# EAGLE design adapter (EAGLE 9.1.3)
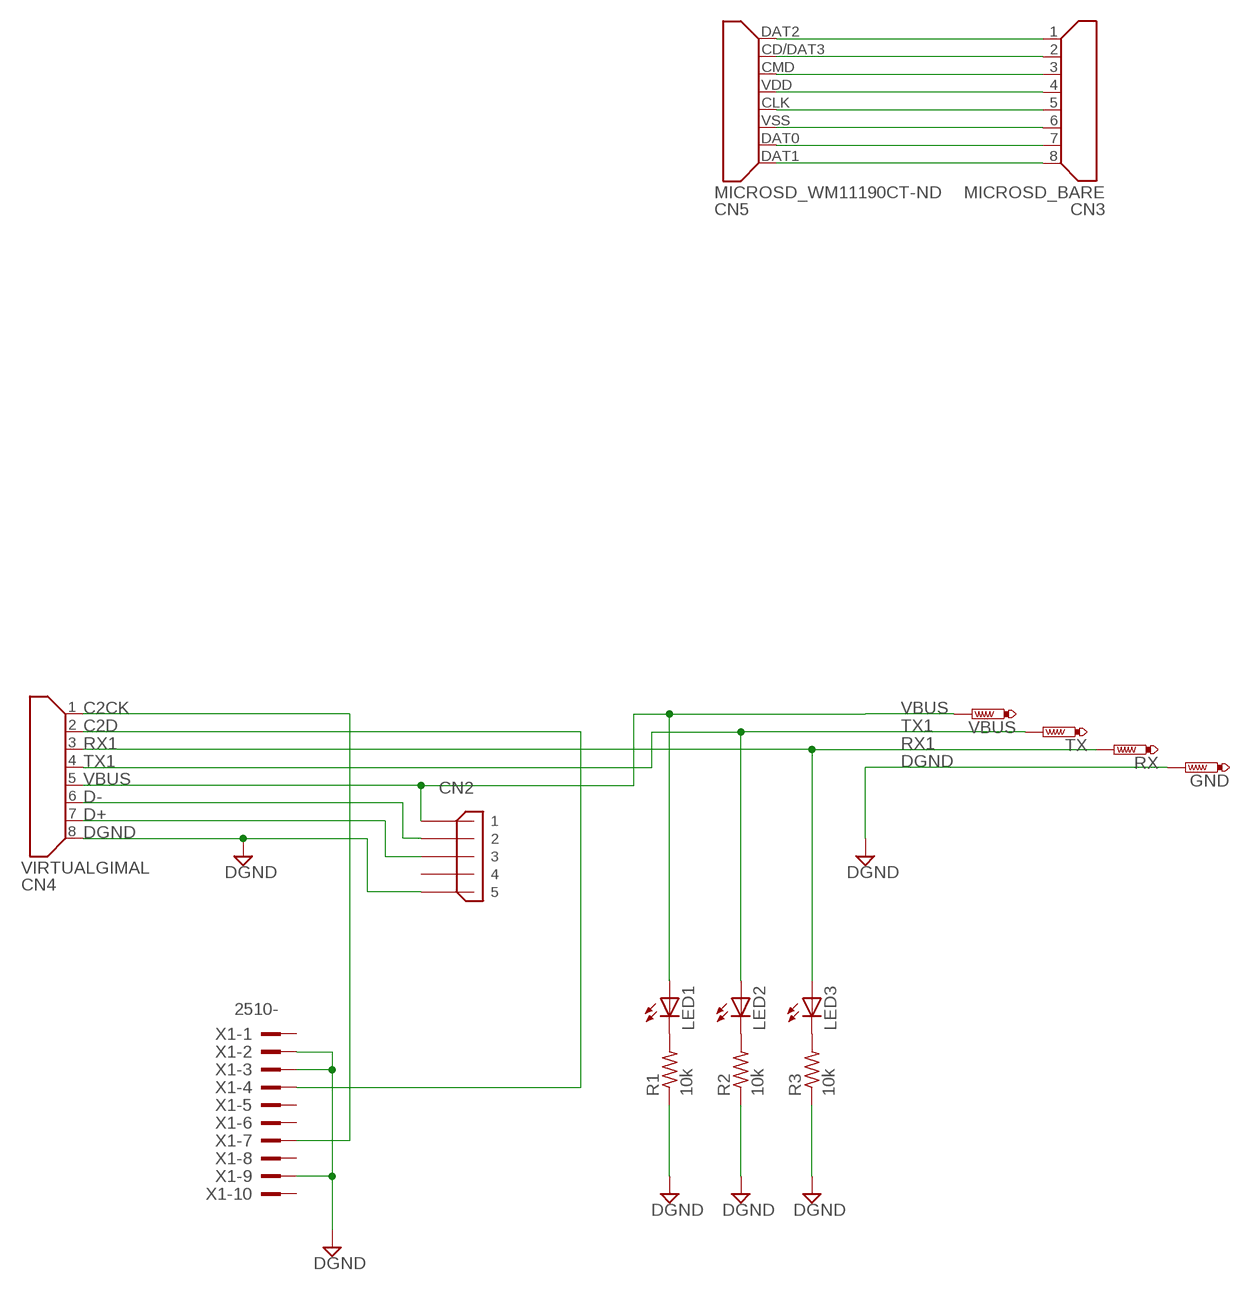
[diagram p0: schematic, sheet 1]

## Parts
CN2  MICROUSB_ZX62D1-B-5PA(30)  [ZX62D1-B-5PA(30)]
CN3  MICROSD_BARE  [MICROSD]
CN4  VIRTUALGIMAL  [VIRTUALGIMBAL]
CN5  MICROSD_WM11190CT-ND  [5033981892]
GND  PTR1TP19R  [TP19R]
LED1  LEDSML0603  [SML0603]
LED2  LEDSML0603  [SML0603]
LED3  LEDSML0603  [SML0603]
R1  10k  R-US_R0402  [R0402]
R2  10k  R-US_R0402  [R0402]
R3  10k  R-US_R0402  [R0402]
RX  PTR1TP19R  [TP19R]
TX  PTR1TP19R  [TP19R]
VBUS  PTR1TP19R  [TP19R]
X1  2510-  [PAK100/2500-10]

## Nets
C2CK [Signal]: CN4.1 X1.7
C2D [Signal]: CN4.2 X1.4
D+ [Signal]: CN2.3_D+ CN4.7
D- [Signal]: CN2.2_D- CN4.6
DGND: CN2.5_GND CN4.8 GND.TP R1.1 R2.1 R3.1 X1.2 X1.3 X1.9
N$1: LED1.C R1.2
N$2: LED2.C R2.2
N$3: LED3.C R3.2
N$4 [Signal]: CN3.1 CN5.DAT2
N$5 [Signal]: CN3.2 CN5.CD/DAT3
N$6 [Signal]: CN3.3 CN5.CMD
N$7: CN3.4 CN5.VDD
N$8 [Signal]: CN3.5 CN5.CLK
N$9: CN3.6 CN5.VSS
N$10 [Signal]: CN3.7 CN5.DAT0
N$11 [Signal]: CN3.8 CN5.DAT1
RX1 [Signal]: CN4.3 LED3.A RX.TP
TX1 [Signal]: CN4.4 LED2.A TX.TP
VBUS: CN2.1_VCC CN4.5 LED1.A VBUS.TP
Unconnected: CN2.4_ID X1.1 X1.5 X1.6 X1.8 X1.10

## Library data of the parts
CN2 = connector:MICROUSB_ZX62D1-B-5PA(30)
CN3 = connector:MICROSD_BARE
CN4 = connector:VIRTUALGIMAL
CN5 = connector:MICROSD_WM11190CT-ND
GND RX TX VBUS = testpad:PTR1: TEST PIN
LED1-LED3 = led:LED: LED OSRAM: - CHIPLED LG R971, LG N971, LY N971, LG Q971, LY Q971, LO R971, LY R971 LH N974, LH R974 LS Q976, LO Q976, LY Q976 LO Q996 - Hyper CHIPLED LW Q18S LB Q993, LB Q99A, LB R99A - SideLED LS A670, LO A670, LY A670, LG A670, LP A670 LB A673, LV A673, LT A673, LW A673 LH A674 LY A675 LS A676, LA A676, LO A676, LY A676, LW A676 LS A679, LY A679, LG A679 - Hyper Micro SIDELED® LS Y876, LA Y876, LO Y876, LY Y876 LT Y87S - SmartLED LW L88C, LW L88S LB L89C, LB L89S, LG L890 LS L89K, LO L89K, LY L89K LS L896, LA L896, LO L896, LY L896 - TOPLED LS T670, LO T670, LY T670, LG T670, LP T670 LSG T670, LSP T670, LSY T670, LOP T670, LYG T670 LG T671, LOG T671, LSG T671 LB T673, LV T673, LT T673, LW T673 LH T674 LS T676, LA T676, LO T676, LY T676, LB T676, LH T676, LSB T676, LW T676 LB T67C, LV T67C, LT T67C, LS T67K, LO T67K, LY T67K, LW E67C LS E67B, LA E67B, LO E67B, LY E67B, LB E67C, LV E67C, LT E67C LW T67C LS T679, LY T679, LG T679 LS T770, LO T770, LY T770, LG T770, LP T770 LB T773, LV T773, LT T773, LW T773 LH T774 LS E675, LA E675, LY E675, LS T675 LS T776, LA T776, LO T776, LY T776, LB T776 LHGB T686 LT T68C, LB T68C - Hyper Mini TOPLED® LB M676 - Mini TOPLED Santana® LG M470 LS M47K, LO M47K, LY M47K Source: http://www.osram.convergy.de LUXEON: - LUMILED® LXK2-PW12-R00, LXK2-PW12-S00, LXK2-PW14-U00, LXK2-PW14-V00 LXK2-PM12-R00, LXK2-PM12-S00, LXK2-PM14-U00 LXK2-PE12-Q00, LXK2-PE12-R00, LXK2-PE12-S00, LXK2-PE14-T00, LXK2-PE14-U00 LXK2-PB12-K00, LXK2-PB12-L00, LXK2-PB12-M00, LXK2-PB14-N00, LXK2-PB14-P00, LXK2-PB14-Q00 LXK2-PR12-L00, LXK2-PR12-M00, LXK2-PR14-Q00, LXK2-PR14-R00 LXK2-PD12-Q00, LXK2-PD12-R00, LXK2-PD12-S00 LXK2-PH12-R00, LXK2-PH12-S00 LXK2-PL12-P00, LXK2-PL12-Q00, LXK2-PL12-R00 Source: www.luxeon.com KINGBRIGHT: KA-3528ASYC Source: www.kingbright.com
R1-R3 = rcl:R-US_: RESISTOR, American symbol; SPICEPREFIX: R
X1 = con-3m:2510-: 3M (TM) Pak 100 4-Wall Header Source: 3M; MF: 3M; MPN: 2510-6002UB; OC_FARNELL: 9838244; OC_NEWARK: 46F4725

## Net classes
0 PWR: width 0.254 mm
1 Signal: width 0.152 mm

## Board
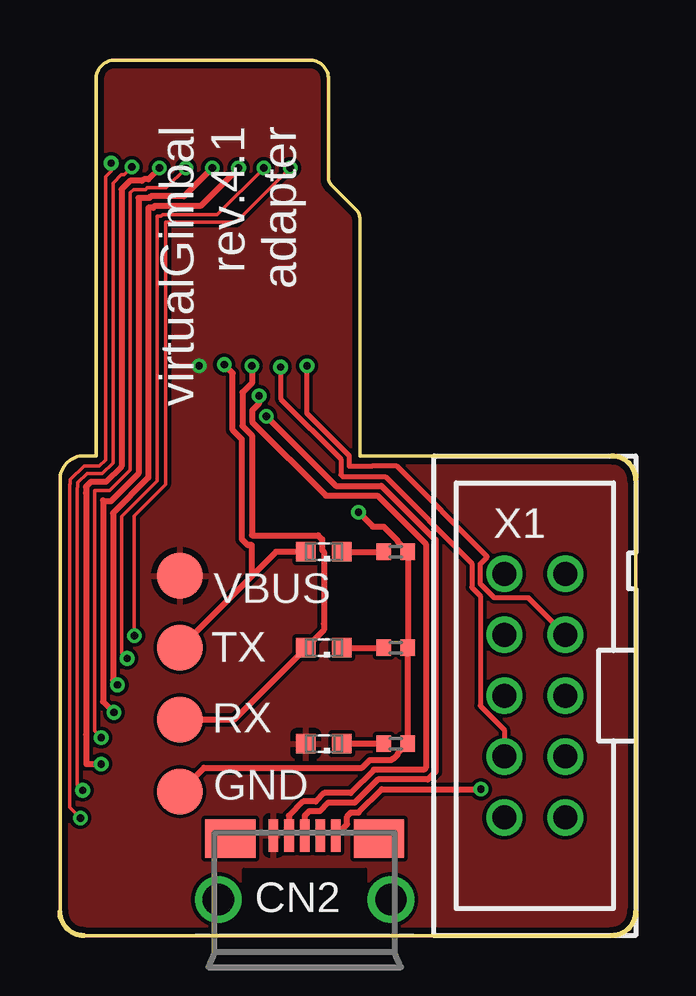
[diagram p1: board, top side]
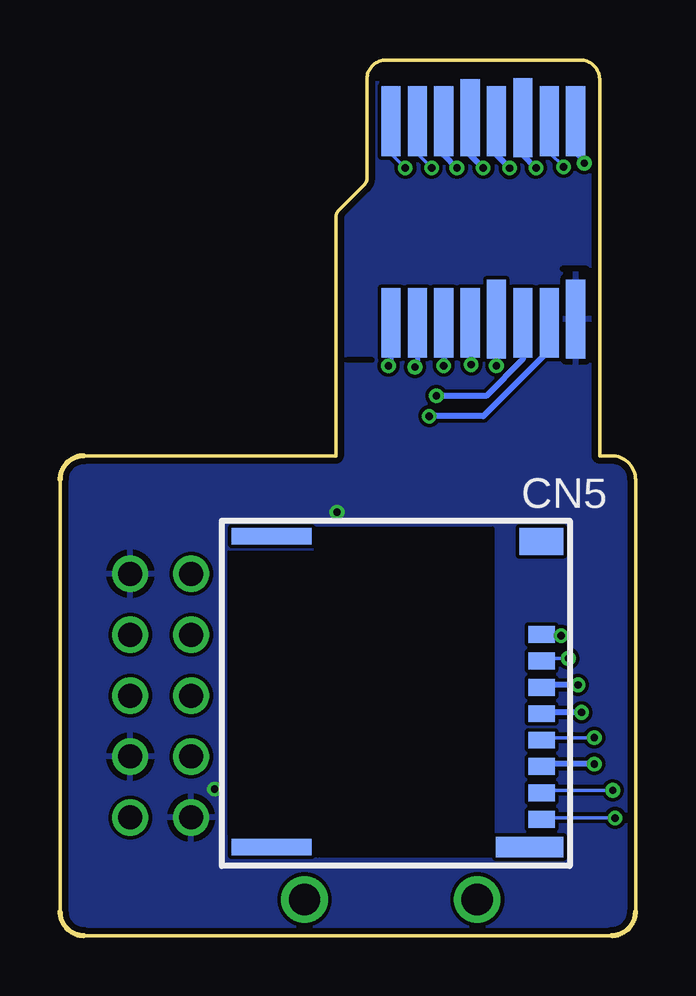
[diagram p2: board, bottom side, seen from below]

Size 24 x 36.5 mm. Coordinates in mm from the lower left corner, seen from the top.
Outline: 0,1 0,19 arc-90 1,20 1.5,20 1.5,35.7 arc-90 2.3,36.5 10.4,36.5 arc-90 11.2,35.7 11.2,31.57 arc45 11.32,31.28 12.38,30.22 arc-45 12.5,29.93 12.5,20 23,20 arc-90 24,19 24,1 arc-90 23,0 1,0 arc-90 0,1
Copper layers (1*16): Top 0.035mm / dielectric 1.5mm / Bottom 0.035mm
Design rules "Elecrow_2-layer_eagle_rule": minimum track width 6mil, minimum drill 12mil, track to track 6mil, track to pad 6mil, pad to pad 6mil, via to via 6mil, smd to smd 0mil, copper to edge 10mil, drill to drill 10mil, minimum pad ring 10mil, minimum via ring 6mil, stop-mask expansion 2mil, vias tented up to drill 100mil, thermal gap 10mil
bRestrict: 2 lines

### Footprints (pad centres in the part's own frame; a part is rotated, then mirrored left to right if it is on the bottom)
ZX62D1-B-5PA(30) = smd 0.4 x 1.35: 1_VCC -1.3,2.675; 2_D- -0.65,2.675; 3_D+ 0,2.675; 4_ID 0.65,2.675; 5_GND 1.3,2.675 | smd 2.1 x 1.6: P$1 -3.1,2.55; P$2 3.1,2.55 | drill 1.3: S1 3.6,0; S4 -3.6,0
MICROSD = smd 0.8 x 2.9: 1 0,0; 2 1.1,0; 3 2.2,0; 5 4.4,0; 7 6.6,0; 8 7.7,0 | smd 0.8 x 3.2: 4 3.3,0.15 | smd 0.8 x 3.3: 6 5.5,0.15
VIRTUALGIMBAL = smd 0.8 x 2.9: 1 0,0; 2 1.1,0; 3 2.2,0; 4 3.3,0; 6 5.5,0; 7 6.6,0 | smd 0.8 x 3.3: 5 4.4,0.15; 8 7.7,0.15
5033981892 = smd 0.7 x 1.1: CD/DAT3 5.55,12.93; CLK 8.85,12.93; CMD 6.65,12.93; DAT0 11.05,12.93; DAT1 12.15,12.93; DAT2 4.45,12.93; VDD 7.75,12.93; VSS 9.95,12.93 | smd 1.14 x 1.83: S1 0.57,12.915 | smd 0.7 x 3.33: S2 0.35,1.665; S3 13.31,1.665 | smd 0.86 x 2.8: S4 13.31,12.43
TP19R = smd 1.9 x 1.9: TP 0,0
SML0603 = smd 0.8 x 0.8: A 0.75,0; C -0.75,0
R0402 = smd 0.6 x 0.7: 1 -0.5,0; 2 0.5,0
PAK100/2500-10 = drill 1 pad 1.422: 1 -5.08,-1.27; 2 -5.08,1.27; 3 -2.54,-1.27; 4 -2.54,1.27; 5 0,-1.27; 6 0,1.27; 7 2.54,-1.27; 8 2.54,1.27; 9 5.08,-1.27; 10 5.08,1.27

### Placement (x,y rotation side)
CN2  10.2,1.5 0 top
CN3  10.2,33.95 0 bottom
CN4  10.2,25.55 0 bottom
CN5  16.85,17 270 bottom
GND  5,6 0 top
LED1  11,8 180 top
LED2  11,16 180 top
LED3  11,12 180 top
R1  14,8 180 top
R2  14,16 180 top
R3  14,12 180 top
RX  5,9 0 top
TX  5,12 0 top
VBUS  5,15 0 top
X1  19.8,10 90 top

### Tracks (layer width: path | path; a pad name or v marks a point on that pad's centre or on a via)
C2CK  (via drill 0.3)
  Top 0.2: 13,19.57 14.04,19.57 17.82,15.79 17.52,15.5 17.52,14.66 18.11,14.07 19.54,14.07 X1.7 | 12.07,20 10.3,21.77 v10.3,23.75
  Top 0.203: 12.07,20 12.07,19.57 13,19.57
  Bottom 0.203: CN4.1 10.2,23.95 10.25,23.9 10.25,23.8 v10.3,23.75
C2D  (via drill 0.3)
  Top 0.2: X1.4 18.53,8.58 17.52,9.58 17.52,14.16 17.17,14.52 17.17,15.52 13.56,19.12 | 11.71,19.21 11.71,19.86 9.2,22.37 v9.2,23.7
  Top 0.203: 11.71,19.21 11.8,19.12 13.56,19.12
  Bottom 0.203: CN4.2 9.1,23.8 v9.2,23.7
D+  (via drill 0.3)
  Top 0.254: CN2.3_D+ 10.2,5 10.39,5.19 10.84,5.19 11.19,5.54 12.29,5.54 13.26,6.51 15.34,6.51 15.66,6.82 15.66,16.49 13.4,18.74 11.51,18.74 v8.6,21.65
  Bottom 0.254: CN4.7 3.6,24.4 6.35,21.65 v8.6,21.65
D-  (via drill 0.3)
  Top 0.254: CN2.2_D- 9.55,5 10.14,5.59 10.67,5.59 11.02,5.94 12.12,5.94 13.09,6.91 15.17,6.91 15.25,6.99 15.25,16.32 13.24,18.34 11.09,18.34 8.02,21.41 8.02,21.89 8.3,22.18 v8.3,22.5
  Bottom 0.254: v8.3,22.5 6.22,22.5 4.7,24.02 CN4.6
DGND  (via drill 0.3)
  Top 0.254: v12.45,17.65 13.05,17.05 13.49,17.05 14.08,16.47 14.08,16.42 R2.1 R3.1 R1.1 14.08,7.58 14.08,7.53 13.92,7.37 13.87,7.37 13.82,7.32 12.92,7.32 12.6,7 6,7 GND.TP | v17.55,6.1 13.43,6.1 12.46,5.13 12.13,5.13 11.97,4.97 11.97,4.65 CN2.5_GND
  pour Bottom: 0,35.56 -1.27,35.56 -1.27,-1.27 24.13,-1.27 24.13,35.56
N$1
  Top 0.254: R1.2 LED1.C
N$2
  Top 0.254: LED2.C R2.2
N$3
  Top 0.254: LED3.C R3.2
N$4  (via drill 0.3)
  Top 0.152: v9.6,32 7.35,29.75 4.4,29.75 4.4,18.8 3.1,17.5 v3.1,12.5
  Bottom 0.152: v3.1,12.5 3.87,12.5 CN5.DAT2 | CN3.1 10.2,32.6 v9.6,32
N$5  (via drill 0.3)
  Top 0.152: v8.5,32 6.55,30.05 4.27,30.05 4.22,30 4.05,30 4.05,18.95 2.57,17.47 2.57,11.78 v2.8,11.55
  Bottom 0.152: v2.8,11.55 3.82,11.55 CN5.CD/DAT3 | CN3.2 9.1,32.6 v8.5,32
N$6  (via drill 0.3)
  Top 0.254: v7.45,32 5.86,30.41 3.96,30.41 3.89,30.34 3.68,30.34 3.68,19.09 2.21,17.61 2.21,10.64 v2.4,10.45
  Bottom 0.254: v2.4,10.45 3.82,10.45 CN5.CMD | CN3.3 8,32.55 v7.45,32
N$7  (via drill 0.3)
  Top 0.254: v2.25,9.3 1.8,9.75 1.8,18.15 1.85,18.1 2.12,18.1 3.28,19.26 3.28,30.75 3.72,30.75 3.79,30.82 5.17,30.82 v6.35,32
  Bottom 0.254: CN3.4 6.9,32.55 v6.35,32 | v2.25,9.3 3.87,9.3 CN5.VDD
N$8  (via drill 0.3)
  Top 0.152: v1.72,8.25 1.44,8.53 1.44,18.3 1.45,18.3 1.45,18.55 2.07,18.55 2.92,19.4 2.92,30.96 3.07,31.1 3.57,31.1 3.64,31.17 4.43,31.17 v5.25,31.99
  Bottom 0.152: v1.72,8.25 3.82,8.25 CN5.CLK
  Bottom 0.254: CN3.5 5.8,32.54 v5.25,31.99
N$9  (via drill 0.3)
  Top 0.254: 1.1,7.15 | 1.1,7.15 v1.72,7.15 | 1.1,7.15 1.1,8.37 1.09,8.38 1.09,18.45 1.09,18.69 1.09,18.71 1.29,18.91 1.92,18.91 2.57,19.56 2.57,31.11 2.92,31.46 3.42,31.46 3.5,31.53 3.68,31.53 v4.15,32
  Bottom 0.254: CN3.6 4.7,32.55 v4.15,32 | v1.72,7.15 3.82,7.15 CN5.VSS
N$10  (via drill 0.3)
  Top 0.152: v0.95,6.05 0.71,6.29 0.71,18.66 0.73,18.69 0.74,18.7 0.74,18.86 0.74,18.88 1.13,19.26 1.77,19.26 2.21,19.7 2.21,31.37 2.56,31.71 2.67,31.71 v3,32.04
  Bottom 0.152: CN3.7 3.6,32.64 v3,32.04 | v0.95,6.05 3.82,6.05 CN5.DAT0
N$11  (via drill 0.3)
  Top 0.152: v0.85,4.9 0.41,5.34 0.41,18.8 0.43,18.82 0.44,18.99 0.44,19 1,19.57 1.64,19.57 1.91,19.83 1.91,31.64 2.13,31.87 v2.13,32.2
  Bottom 0.152: CN3.8 2.5,32.56 v2.13,32.2 | v0.85,4.9 3.87,4.9 CN5.DAT1
RX1  (via drill 0.3)
  Top 0.254: RX.TP 7.25,9 LED3.A 11,12.75 11,13 11,16 10.93,16.07 10.93,16.52 10.77,16.68 8,16.68 8,20.85 7.61,21.24 7.61,22.64 8,23.03 v8,23.75
  Bottom 0.254: CN4.3 v8,23.75
TX1  (via drill 0.3)
  Top 0.254: LED2.A 9,16 8,15 | 8,15 TX.TP | v6.85,23.8 7.2,23.45 7.2,21.07 7.59,20.68 7.59,16.51 7.83,16.27 8,16.27 8,15
  Bottom 0.254: CN4.4 6.9,23.85 v6.85,23.8
VBUS  (via drill 0.3)
  Bottom 0.254: CN4.5 v5.8,23.75
  pour Top: -1.27,36.83 -1.27,-2.54 25.4,-2.54 25.4,36.83

### Text on the board
tNames: virtualGimbal / rev.4.1 / adapter